# Altium schematic sheet TEC_CONTROLLER_1.SchDoc: Laser PCB
size A3; DrawnBy: James Singleton; Organization: TMC Technology Ltd.; DocumentNumber: 11; Revision: A; SheetNumber: 10; SheetTotal: 18; Drawn Date: 22/12/2020
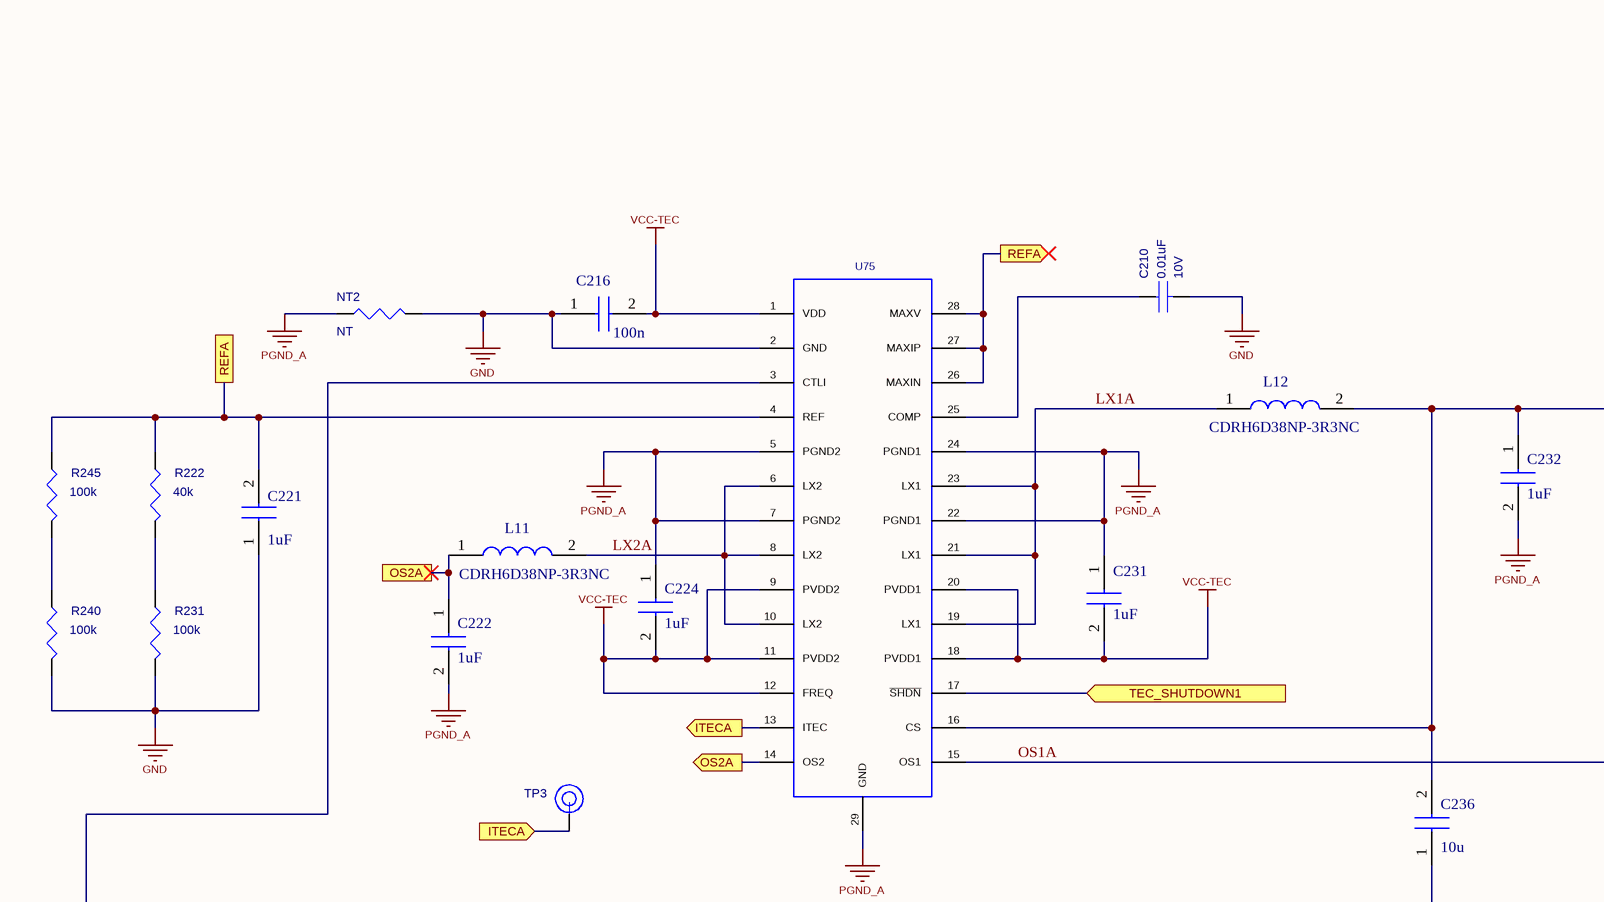
[diagram p0: TEC_CONTROLLER_1.SchDoc, top left]
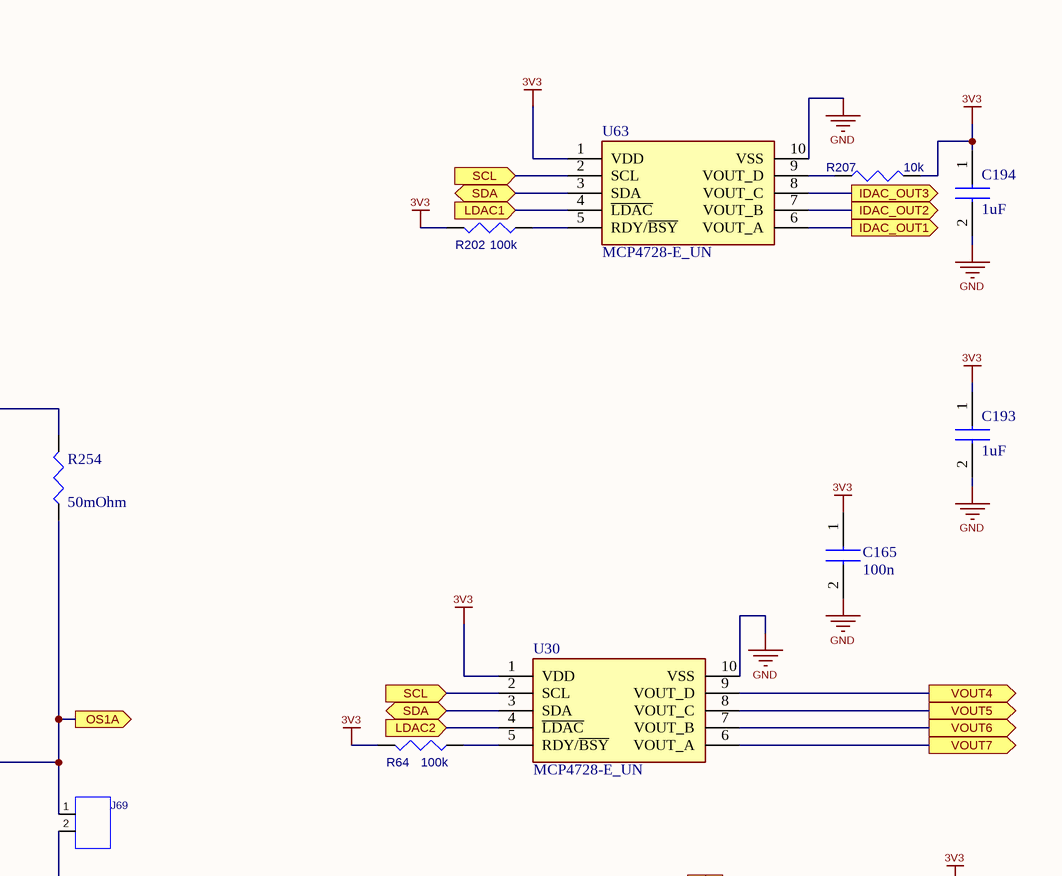
[diagram p1: TEC_CONTROLLER_1.SchDoc, top right]
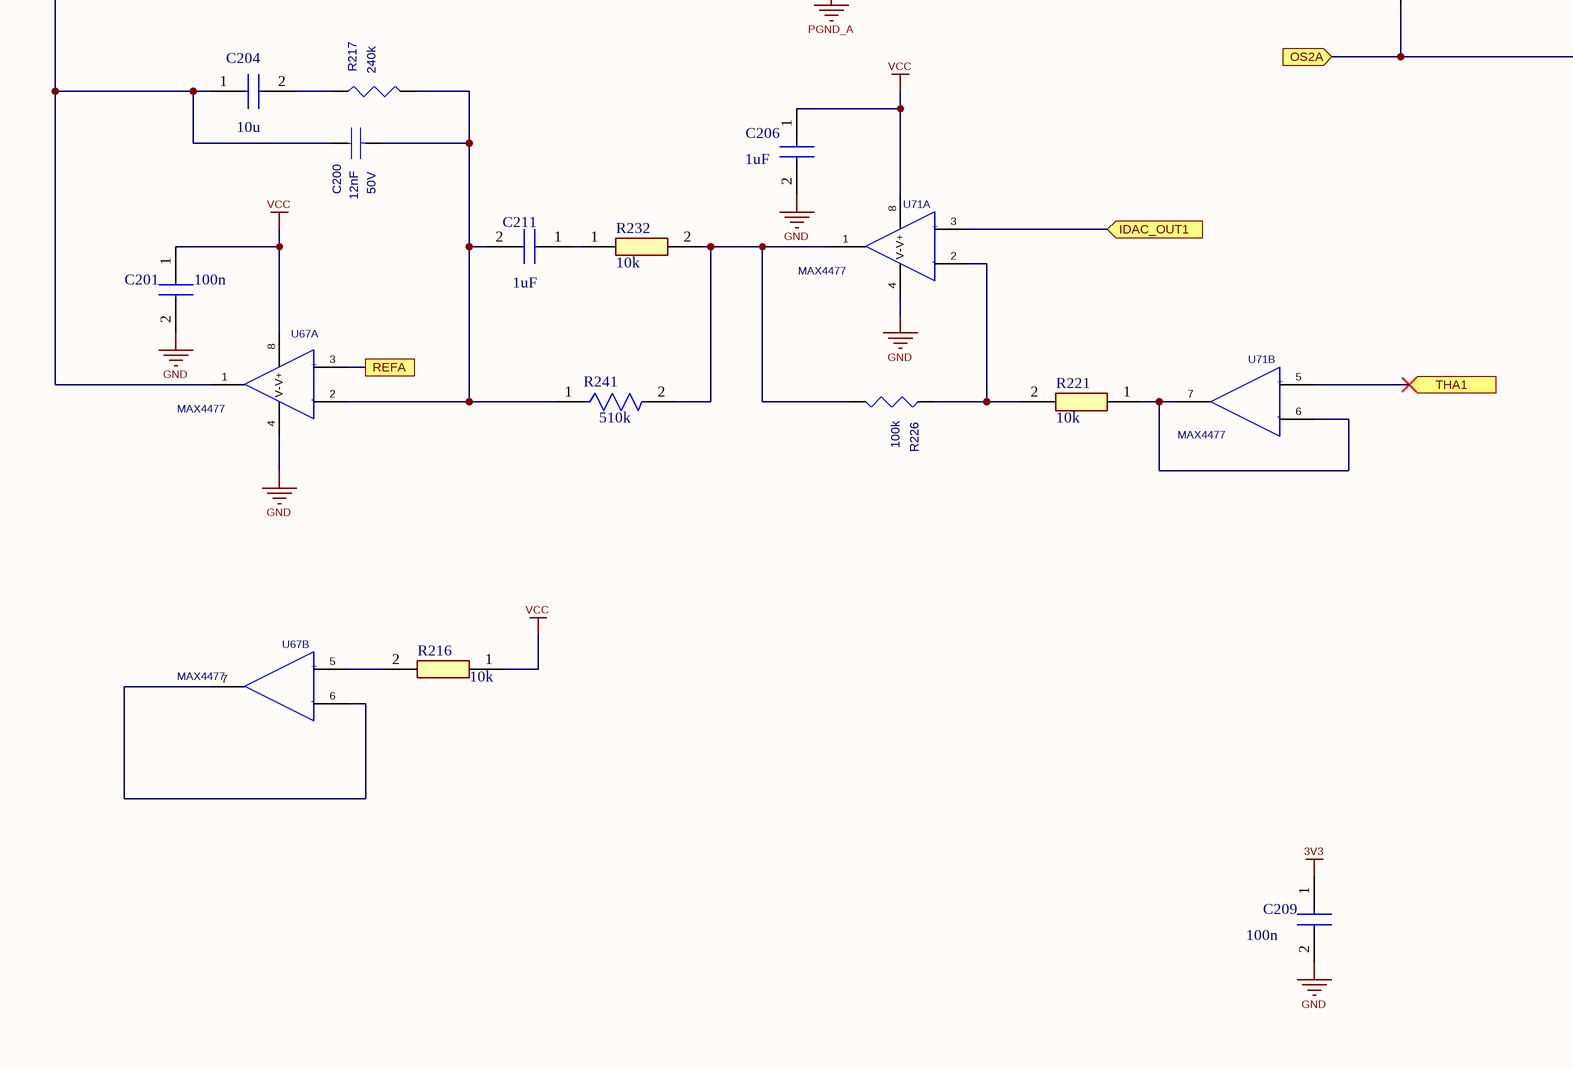
[diagram p2: TEC_CONTROLLER_1.SchDoc, bottom left]
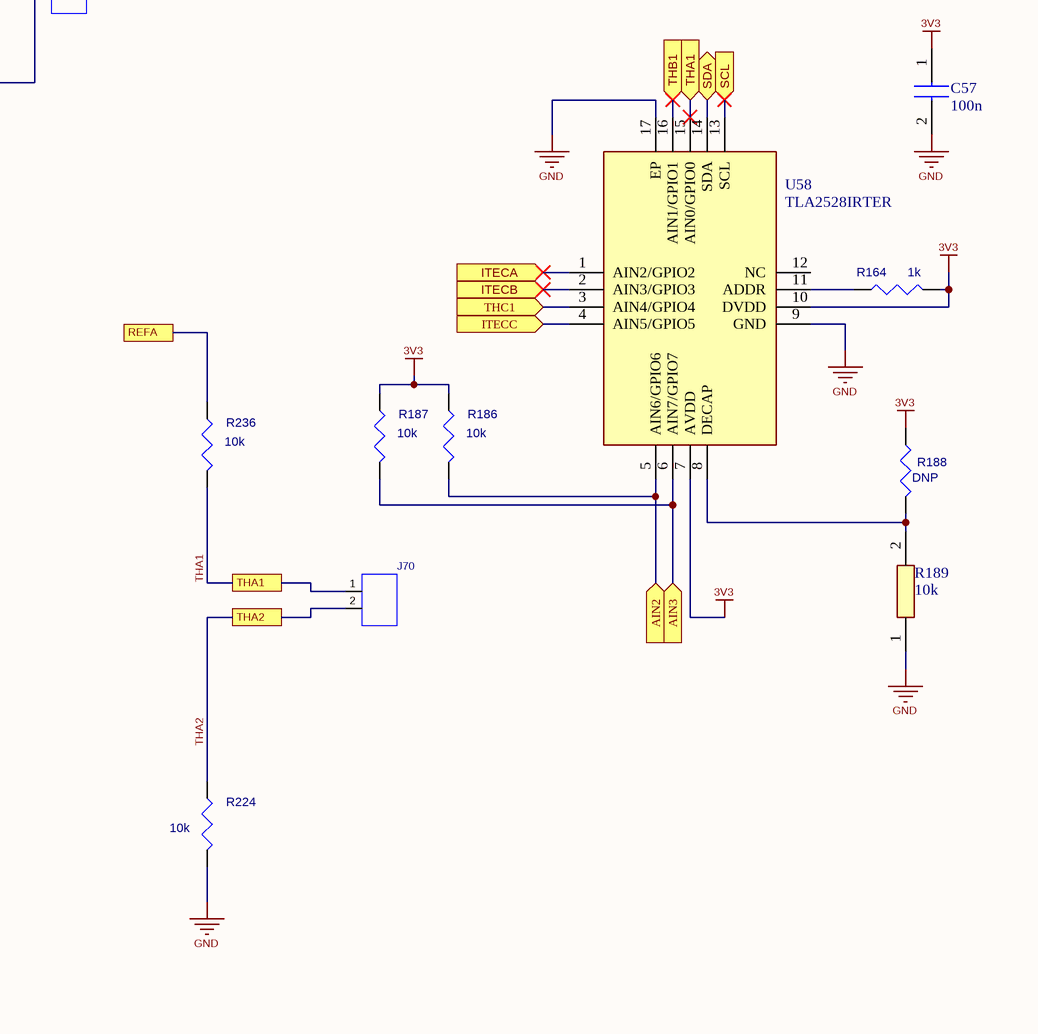
[diagram p3: TEC_CONTROLLER_1.SchDoc, bottom right]

## Parts
C57  100n  [CAPC1608X90N]
C165  100n  [CAPC1608X90N]
C193  1uF  [CAPC1608X95N]
C194  1uF  [CAPC1608X95N]
C200  value 12nF  Rated_Voltage: 50V  [CC0603N]  (hidden comment: 12n)
C201  100n  [CAPC1608X90N]
C204  10u  [CAPC1608X90N]
C206  1uF  [CAPC1608X95N]
C209  100n  [CAPC1608X90N]
C210  value 0.01uF  Rated_Voltage: 10V  [CC0603N]  (hidden comment: 10n)
C211  1uF  [CAPC1608X95N]
C216  100n  [CAPC1608X90N]
C221  1uF  [CAPC1608X95N]
C222  1uF  [CAPC1608X95N]
C224  1uF  [CAPC1608X95N]
C231  1uF  [CAPC1608X95N]
C232  1uF  [CAPC1608X95N]
C236  10u  [CAPC1608X90N]
J69  CON02  [AE-6410-2W-VERTICAL]  (value not drawn)
J70  CON02  [AE-6410-2W-VERTICAL]  (value not drawn)
L11  CDRH6D38NP-3R3NC  [CDRH6D38NP3R3NC]
L12  CDRH6D38NP-3R3NC  [CDRH6D38NP3R3NC]
NT2  value NT  [NetTie]  (hidden comment: Net Tie)  (net tie, no BOM)
R64  100k  [CR0603N]
R164  1k  [CR0603N]
R186  value 10k  [CR0603N]  (hidden comment: RES)
R187  value 10k  [CR0603N]  (hidden comment: RES)
R188  DNP  [CR0603N]
R189  10k  [RESC1608X55N]
R202  100k  [CR0603N]
R207  value 10k  [CR0603N]  (hidden comment: RES)
R216  10k  [RESC1608X55N]
R217  240k  [CR0603N]
R221  10k  [RESC1608X55N]
R222  40k  [CR0603N]
R224  value 10k  [CR0603N]  (hidden comment: RES)
R226  100k  [CR0603N]
R231  100k  [CR0603N]
R232  10k  [RESC1608X55N]
R236  value 10k  [CR0603N]  (hidden comment: RES)
R240  100k  [CR0603N]
R241  Resistance: 510k  [FP-CR0603-MFG]  (hidden comment: CR0603-JW-514ELF)
R245  100k  [CR0603N]
R254  value 50mOhm  [RESC3216X89N]  (hidden comment: PE1206FRE470R05L)
TP3  DNP  [MILLMAX3210]  (value not drawn)
U30  MCP4728-E_UN  [SOP50P490X110-10N]
U58  TLA2528IRTER  [QFN50P300X300X80-17N-D]
U63  MCP4728-E_UN  [SOP50P490X110-10N]
U67  MAX4477  [SOP65P490X110-8CN]  (parts A,B of 2)
U71  MAX4477  [SOP65P490X110-8CN]  (parts A,B of 2)
U75  (no value)  [SOP65P638X110-29N]

## Ports
AIN2 (in), AIN3 (in), IDAC_OUT1 (in, see TEC_CONTROLLER_1[8A]), IDAC_OUT1 (out, see TEC_CONTROLLER_1[4C]), IDAC_OUT2 (out, see TEC_CONTROLLER_2[4C]), IDAC_OUT3 (out, see TEC_CONTROLLER_3[4C]), ITECA (in, see TEC_CONTROLLER_1[2B], TEC_CONTROLLER_1[3B]), ITECA (in, see TEC_CONTROLLER_1[3B], TEC_CONTROLLER_1[7C]), ITECA (out, see TEC_CONTROLLER_1[2B], TEC_CONTROLLER_1[7C]), ITECB (in, see TEC_CONTROLLER_2[2B], TEC_CONTROLLER_2[3B]), ITECC (in, see TEC_CONTROLLER_3[2B], TEC_CONTROLLER_3[3B]), LDAC1 (in, see PI_INTERFACE[3A]), LDAC2 (in, see PI_INTERFACE[3A]), OS1A (out), OS2A (in, see TEC_CONTROLLER_1[2B], TEC_CONTROLLER_1[3B]), OS2A (out, see TEC_CONTROLLER_1[2B], TEC_CONTROLLER_1[5B]), OS2A (see TEC_CONTROLLER_1[3B], TEC_CONTROLLER_1[5B]), REFA (out, see TEC_CONTROLLER_1[1A], TEC_CONTROLLER_1[2C], TEC_CONTROLLER_1[6C]), REFA (see TEC_CONTROLLER_1[1A], TEC_CONTROLLER_1[2C], TEC_CONTROLLER_1[4A]), REFA (see TEC_CONTROLLER_1[1A], TEC_CONTROLLER_1[4A], TEC_CONTROLLER_1[6C]), REFA (see TEC_CONTROLLER_1[2C], TEC_CONTROLLER_1[4A], TEC_CONTROLLER_1[6C]), SCL (in, see ADC-DAC[2C], ADC-DAC[3A], ADC-DAC[4B], ADC-DAC[4C], ADC-DAC[5C], ADC-DAC[6A], Fan & Power Out[6A], PI_INTERFACE[3A], TEC_CONTROLLER_1[6B], TEC_CONTROLLER_1[7A]), SCL (in, see ADC-DAC[2C], ADC-DAC[3A], ADC-DAC[4B], ADC-DAC[4C], ADC-DAC[5C], ADC-DAC[6A], Fan & Power Out[6A], PI_INTERFACE[3A], TEC_CONTROLLER_1[6B], TEC_CONTROLLER_1[8B]), SCL (in, see ADC-DAC[2C], ADC-DAC[3A], ADC-DAC[4B], ADC-DAC[4C], ADC-DAC[5C], ADC-DAC[6A], Fan & Power Out[6A], PI_INTERFACE[3A], TEC_CONTROLLER_1[7A], TEC_CONTROLLER_1[8B]), SDA (bidir, see ADC-DAC[2C], ADC-DAC[3A], ADC-DAC[4B], ADC-DAC[4C], ADC-DAC[5C], ADC-DAC[6A], Fan & Power Out[6A], PI_INTERFACE[3A], TEC_CONTROLLER_1[6B], TEC_CONTROLLER_1[7A]), SDA (bidir, see ADC-DAC[2C], ADC-DAC[3A], ADC-DAC[4B], ADC-DAC[4C], ADC-DAC[5C], ADC-DAC[6A], Fan & Power Out[6A], PI_INTERFACE[3A], TEC_CONTROLLER_1[6B], TEC_CONTROLLER_1[7B]), SDA (bidir, see ADC-DAC[2C], ADC-DAC[3A], ADC-DAC[4B], ADC-DAC[4C], ADC-DAC[5C], ADC-DAC[6A], Fan & Power Out[6A], PI_INTERFACE[3A], TEC_CONTROLLER_1[7A], TEC_CONTROLLER_1[7B]), TEC_SHUTDOWN1 (in, see PIO[2C]), THA1 (in, see TEC_CONTROLLER_1[5C], TEC_CONTROLLER_1[6C]), THA1 (in, see TEC_CONTROLLER_1[6C], TEC_CONTROLLER_1[7B]), THA1 (see TEC_CONTROLLER_1[5C], TEC_CONTROLLER_1[7B]), THA2, THB1 (in, see TEC_CONTROLLER_2[5C], TEC_CONTROLLER_2[6D]), THC1 (in, see TEC_CONTROLLER_3[5C], TEC_CONTROLLER_3[6D]), VOUT4 (out, see LIM+LEDS+POWER[1A]), VOUT5 (out, see LIM+LEDS+POWER[1B]), VOUT6 (out, see LIM+LEDS+POWER[1C]), VOUT7 (out, see LIM+LEDS+POWER[1C])

## Nets
3V3: C57.1 C165.1 C193.1 C194.1 C209.1 R64.1 R164.2 R186.1 R187.1 R188.1 R202.1 R207.2 U30.1(VDD) U58.7(AVDD) U58.10(DVDD) U63.1(VDD)
GND: C57.2 C165.2 C193.2 C194.2 C201.2 C206.2 C209.2 C210.2 C216.1 C221.1 NT2.1 R189.1 R224.2 R231.2 R240.2 U30.10(VSS) U58.9(GND) U58.17(EP) U63.10(VSS) U67.4(V-) U71.4(V-) U75.2(GND)
PGND_A: C222.2 C224.1 C231.1 C232.2 NT2.2 U75.5(PGND2) U75.7(PGND2) U75.22(PGND1) U75.24(PGND1) U75.29(GND)
VCC: C201.1 C206.1 R216.1 U67.8(V+) U71.8(V+)
VCC-TEC: C216.2 C224.2 C231.2 U75.1(VDD) U75.9(PVDD2) U75.11(PVDD2) U75.12(FREQ) U75.18(PVDD1) U75.20(PVDD1)
AIN2: R186.2 U58.5(AIN6/GPIO6) ; port AIN2
AIN3: R187.2 U58.6(AIN7/GPIO7) ; port AIN3
IDAC_OUT1: U63.6(VOUT_A) U71.3 ; port IDAC_OUT1
IDAC_OUT2: U63.7(VOUT_B) ; port IDAC_OUT2
IDAC_OUT3: U63.8(VOUT_C) ; port IDAC_OUT3
ITECA: TP3.1 U58.1(AIN2/GPIO2) U75.13(ITEC) ; port ITECA
ITECB: U58.2(AIN3/GPIO3) ; port ITECB
ITECC: U58.4(AIN5/GPIO5) ; port ITECC
LDAC1: U63.4(~{LDAC}) ; port LDAC1
LDAC2: U30.4(~{LDAC}) ; port LDAC2
LX1A: L12.1 U75.19(LX1) U75.21(LX1) U75.23(LX1)
LX2A: L11.2 U75.6(LX2) U75.8(LX2) U75.10(LX2)
OS1A: J69.1 R254.1 U75.15(OS1) ; port OS1A
OS2A: C222.1 C236.1 J69.2 L11.1 U75.14(OS2) ; port OS2A
REFA: C221.2 R222.1 R236.1 R245.1 U67.3 U75.4(REF) U75.26(MAXIN) U75.27(MAXIP) U75.28(MAXV) ; port REFA
SCL: U30.2(SCL) U58.13(SCL) U63.2(SCL) ; port SCL
SDA: U30.3(SDA) U58.14(SDA) U63.3(SDA) ; port SDA
TEC_SHUTDOWN1: U75.17(~{SHDN}) ; port TEC_SHUTDOWN1
THA1: J70.1 R236.2 U58.15(AIN0/GPIO0) U71.5 ; port THA1
THA2: J70.2 R224.1 ; port THA2
THB1: U58.16(AIN1/GPIO1) ; port THB1
THC1: U58.3(AIN4/GPIO4) ; port THC1
VOUT4: U30.9(VOUT_D) ; port VOUT4
VOUT5: U30.8(VOUT_C) ; port VOUT5
VOUT6: U30.7(VOUT_B) ; port VOUT6
VOUT7: U30.6(VOUT_A) ; port VOUT7
NetC200_1: C200.1 C204.1 U67.1 U75.3(CTLI)
NetC200_2: C200.2 C211.2 R217.2 R241.1 U67.2
NetC204_2: C204.2 R217.1
NetC210_1: C210.1 U75.25(COMP)
NetC211_1: C211.1 R232.1
NetC232_1: C232.1 C236.2 L12.2 R254.2 U75.16(CS)
NetR64_2: R64.2 U30.5(RDY/~{BSY})
NetR164_1: R164.1 U58.11(ADDR)
NetR188_2: R188.2 R189.2 U58.8(DECAP)
NetR202_2: R202.2 U63.5(RDY/~{BSY})
NetR207_1: R207.1 U63.9(VOUT_D)
NetR216_2: R216.2 U67.5
NetR221_1: R221.1 U71.6 U71.7
NetR221_2: R221.2 R226.1 U71.2
NetR222_2: R222.2 R231.1
NetR226_2: R226.2 R232.2 R241.2 U71.1
NetR240_1: R240.1 R245.2
NetU67_6: U67.6 U67.7

Not connected (* = marked no-connect by the designer): U58 12(NC)

## Notes on the sheet
- TMC Technology Ltd.
- Page Contents:
- Project:
- Variant:
- Checked By:
- Size:
- Date:
- Dwg No:
- Sheet
- of
- Revision:
- (in symbol MAX4477, part A) +; -
- (in symbol MAX4477, part B) +; -

## Library data of the parts
C57 C165 C201 C209 C216 = CL10B104KB85PNC: Capacitor; Manufacturer_Name: SAMSUNG; Datasheet Link: https://product.samsungsem.com/mlcc/CL10B104KB85PN.do; Height: 0.9mm; Manufacturer_Part_Number: CL10B104KB85PNC; Mouser Part Number: 187-CL10B104KB85PNC; Mouser Price/Stock: https://www.mouser.co.uk/ProductDetail/Samsung-Electro-Mechanics/CL10B104KB85PNC?qs=349EhDEZ59rqeQxdKfSn5w%3D%3D; Arrow Part Number: CL10B104KB85PNC; Arrow Price/Stock: https://www.arrow.com/en/products/cl10b104kb85pnc/samsung-electro-mechanics
  C201 C209 C216: ClassName: TEC1
C193 C194 C206 C211 C221 C222 C224 C231 C232 = CL10B105KB8NQNC: Capacitor; Manufacturer_Name: SAMSUNG; Datasheet Link: https://product.samsungsem.com/mlcc/CL10B105KB8NQN.do; Height: 0.95mm; Manufacturer_Part_Number: CL10B105KB8NQNC; Mouser Part Number: 187-CL10B105KB8NQNC; Mouser Price/Stock: https://www.mouser.co.uk/ProductDetail/Samsung-Electro-Mechanics/CL10B105KB8NQNC?qs=Jm2GQyTW%2FbjBq1uiSyA2AQ%3D%3D; Arrow Part Number: CL10B105KB8NQNC; Arrow Price/Stock: https://www.arrow.com/en/products/cl10b105kb8nqnc/samsung-electro-mechanics?region=europe
  C206 C211 C221 C222 C224 C231 C232: ClassName: TEC1
C200 = CAP: Cap., 0.012µF ±10% 50V Ceramic X7R 0603 (1608 Metric); PART_NUMBER: 478-1228-1-ND; Manufacturer: AVX; Manufacturer_PN: 06035C123KAT2A; FPLIST: CC0603N,CC0603L,CC0603M; Dielectric_Type: X5R; CLASS: DISCRETE; Source_Path: \\MIL-NS1\CIP\SCHEMATIC_SYMBOLS\LTC_CAPACITOR.OLB; Geometry.Height: 37.40mil; Package_Size: 0603; Package_Type: SMD; Tolerance: 10%; PCB DECAL: CC0603N; ClassName: TEC1
C204 C236 = GRM188Z71A106MA73J: Capacitor; Manufacturer_Name: Murata Electronics; Value: 10uF; Datasheet Link: http://componentsearchengine.com/Datasheets/1/GRM188Z71A106MA73J.pdf; Height: 0.9mm; Manufacturer_Part_Number: GRM188Z71A106MA73J; Mouser Part Number: 81-GRM188Z71A106MA3J; Mouser Price/Stock: https://www.mouser.com/Search/Refine.aspx?Keyword=81-GRM188Z71A106MA3J; Arrow Part Number: GRM188Z71A106MA73J; Arrow Price/Stock: https://www.arrow.com/en/products/grm188z71a106ma73j/murata-manufacturing; ClassName: TEC1
C210 = CAP: CAP.,0.01uF,X5R,10V,10%,0603; Manufacturer_PN: 0603ZD103KAT2A; Manufacturer: AVX; CLASS: DISCRETE; FPLIST: CC0603N,CC0603L,CC0603M; Source_Path: \\MIL-NS1\CIP\SCHEMATIC_SYMBOLS\LTC_CAPACITOR.OLB; Geometry.Height: 37.40mil; Tolerance: 10%; Dielectric_Type: X5R; Package_Size: 0603; PCB DECAL: CC0603N; ClassName: TEC1
J69 J70 = CON02: 2 pin Connector; Manufacturer: Molex; UNNAMED1: DNF; Order No: 1360130; PCB DECAL: AE-6410-2W-VERTICAL; Part No: 22-29-2021; ClassName: TEC1
  J70: System: Connector
L11 L12 = CDRH6D38NP-3R3NC: Inductor; Manufacturer_Name: Sumida; Datasheet Link: http://products.sumida.com/products/pdf/CDRH6D38.pdf; Manufacturer_Part_Number: CDRH6D38NP-3R3NC; Mouser Part Number: 851-CDRH6D38NP-3R3NC; Mouser Price/Stock: https://www.mouser.co.uk/ProductDetail/Sumida/CDRH6D38NP-3R3NC?qs=yEEOfDmvQDXre4MvBRE7jQ%3D%3D; Arrow Part Number: CDRH6D38NP-3R3NC; Arrow Price/Stock: https://www.arrow.com/en/products/cdrh6d38np-3R3nc/sumida?region=nac; Height: 4mm
NT2 = NetTie: Manufacturer_PN: ERJ3EKF1002V; Manufacturer: PANASONIC; Part No: P10.0KHCT-ND; PCB DECAL: CR0603N; CLASS: DISCRETE; Rated_Power: 1/10W; Tolerance: 1%; Temperature_Coefficient: 100ppm/C; FPLIST: CR0603N,CR0603L,CR0603M; Source_Path: \\MIL-NS1\CIP\SCHEMATIC_SYMBOLS\LTC_RESISTOR.OLB; Geometry.Height: 37.40mil; Package_Size: 0603
R64 R202 R226 R231 R240 R245 = RES: RES.,100k OHMS,1%,1/10W,0603; Manufacturer_PN: ERJ3EKF1003V; Manufacturer: PANASONIC; PART_NUMBER: P100KHCT-ND; CLASS: DISCRETE; Temperature_Coefficient: 100ppm/C; FPLIST: CR0603N,CR0603L,CR0603M; Source_Path: \\MIL-NS1\CIP\SCHEMATIC_SYMBOLS\LTC_RESISTOR.OLB; Geometry.Height: 37.40mil; PCB DECAL: CR0603N; Rated_Power: 1/10W; Tolerance: 1%; Package_Size: 0603; Value: 100k
  R226 R231 R240 R245: ClassName: TEC1
R164 = RES: RES.,1k OHMS,1%,1/10W,0603; Manufacturer_PN: ERJ3EKF1001V; Manufacturer: PANASONIC; PART_NUMBER: P1.0KHCT-ND; CLASS: DISCRETE; Temperature_Coefficient: 100ppm/C; FPLIST: CR0603N,CR0603L,CR0603M; Source_Path: \\MIL-NS1\CIP\SCHEMATIC_SYMBOLS\LTC_RESISTOR.OLB; Geometry.Height: 37.40mil; PCB DECAL: CR0603N; Rated_Power: 1/10W; Tolerance: 1%; Package_Size: 0603; Value: 1k
R186 R187 R207 R224 R236 = RES: RES.,10k OHMS,1%,1/10W,0603; Manufacturer_PN: ERJ3EKF1002V; Manufacturer: PANASONIC; Part No: P10.0KHCT-ND; CLASS: DISCRETE; Temperature_Coefficient: 100ppm/C; FPLIST: CR0603N,CR0603L,CR0603M; Source_Path: \\MIL-NS1\CIP\SCHEMATIC_SYMBOLS\LTC_RESISTOR.OLB; Geometry.Height: 37.40mil; PCB DECAL: CR0603N; Rated_Power: 1/10W; Tolerance: 1%; Package_Size: 0603
  R186 R187 R224 R236: ClassName: TEC1
R188 = RES_1: RES.,10k OHMS,1%,1/10W,0603; Manufacturer_PN: ERJ3EKF1002V; Manufacturer: PANASONIC; Part No: P10.0KHCT-ND; CLASS: DISCRETE; Temperature_Coefficient: 100ppm/C; FPLIST: CR0603N,CR0603L,CR0603M; Source_Path: \\MIL-NS1\CIP\SCHEMATIC_SYMBOLS\LTC_RESISTOR.OLB; Geometry.Height: 37.40mil; PCB DECAL: CR0603N; Rated_Power: 1/10W; Tolerance: 1%; Package_Size: 0603; Value: DNP
R189 R216 R221 R232 = CR0603-JW-103ELF: Resistor; Manufacturer_Name: Bourns; Datasheet Link: https://www.bourns.com/pdfs/chpreztr.pdf; Height: 0.55mm; Manufacturer_Part_Number: CR0603-JW-103ELF; Mouser Part Number: 652-CR0603-JW-103ELF; Mouser Price/Stock: https://www.mouser.co.uk/ProductDetail/Bourns/CR0603-JW-103ELF?qs=tprK%2FdUq6q6vORSl%252Bpo4rg%3D%3D; Arrow Part Number: CR0603-JW-103ELF; Arrow Price/Stock: https://www.arrow.com/en/products/cr0603-jw-103elf/bourns?utm_currency=USD&region=nac
R217 = RES: RES.,240k OHMS,1%,1/10W,0603; Manufacturer: PANASONIC; CLASS: DISCRETE; Temperature_Coefficient: 100ppm/C; FPLIST: CR0603N,CR0603L,CR0603M; Source_Path: \\MIL-NS1\CIP\SCHEMATIC_SYMBOLS\LTC_RESISTOR.OLB; Geometry.Height: 37.40mil; PCB DECAL: CR0603N; Rated_Power: 1/10W; Tolerance: 1%; Package_Size: 0603; Value: 240k; ClassName: TEC1
R222 = RES: RES.,40k OHMS,1%,1/10W,0603; Manufacturer_PN: CRCW0603560KFKEA; Manufacturer: VISHAY; PART_NUMBER: 2138575; CLASS: DISCRETE; Temperature_Coefficient: 100ppm/C; FPLIST: CR0603N,CR0603L,CR0603M; Source_Path: \\MIL-NS1\CIP\SCHEMATIC_SYMBOLS\LTC_RESISTOR.OLB; Geometry.Height: 37.40mil; PCB DECAL: CR0603N; Rated_Power: 1/10W; Tolerance: 1%; Package_Size: 0603; Value: 40k; ClassName: TEC1
R241 = CMP-07231-004798-1: Thick Film Chip Resistors 0603 510kΩ 0.1W 5% 200ppm/°C; Max Power Dissipation: 100mW; Voltage Rating: 50V; Number of Terminations: 2; Radiation Hardening: No; Features: Moisture Resistant; Military Standard: Not; Width: 0.031inch; Case Code (Imperial): 0603; Tolerance: 5%; Height: 0.022inch; Min Operating Temperature: -55°C; Packaging: Tape and Reel; Case Code (Metric): 1608; Contact Plating: Tin; Mount: Surface Mount; Max Operating Temperature: 155°C; Length: 1.6mm; Temperature Coefficient: 200ppm/°C; Power Rating: 100mW; Depth: 0.8mm; Termination: SMD/SMT; Composition: Thick Film; Package Quantity: 5000; Thickness: 457um; Case/Package: 0603
R254 = PE1206FRE470R05L: Resistor; Manufacturer_Name: YAGEO; Datasheet Link: https://www.yageo.com/upload/media/product/productsearch/datasheet/rchip/PYu-PE_521_RoHS_L_10.pdf; Height: 0.89mm; Manufacturer_Part_Number: PE1206FRE470R05L; Mouser Part Number: 603-PE1206FRE470R05L; Mouser Price/Stock: https://www.mouser.co.uk/ProductDetail/YAGEO/PE1206FRE470R05L?qs=eP2BKZSCXI5fQbfM3JSqUA%3D%3D
TP3 = MILLMAX3210: TEST POINT,TURRET,0.031",MTG. HOLE; Manufacturer_PN: 3210-2-00-01-00-00-08-0; Manufacturer: MILL-MAX; PART_FIELD_01: GND; Value: TEST POINT, DNF; Source_Path: \\MIL-NS1\CIP\SCHEMATIC_SYMBOLS\LTC_HARDWARE.OLB; CLASS: IO; PCB DECAL: MILLMAX3210; ClassName: TEC1
U30 U63 = MCP4728-E_UN: Integrated Circuit; Manufacturer_Name: Microchip; Manufacturer_Part_Number: MCP4728-E/UN; Datasheet Link: http://ww1.microchip.com/downloads/en/DeviceDoc/22187E.pdf; Height: 1.1mm; Mouser Part Number: 579-MCP4728-E/UN; Mouser Price/Stock: https://www.mouser.co.uk/ProductDetail/Microchip-Technology-Atmel/MCP4728-E-UN?qs=E6wAi2XWqcP2zTenScklGA%3D%3D; Arrow Part Number: MCP4728-E/UN; Arrow Price/Stock: https://www.arrow.com/en/products/mcp4728-eun/microchip-technology?region=nac
U58 = TLA2528IRTER: Integrated Circuit; Manufacturer_Name: Texas Instruments; Datasheet Link: https://www.ti.com/lit/ds/symlink/tla2528.pdf?ts=1596615195592&ref_url=https%253A%252F%252Fwww.ti.com%252Fproduct%252FTLA2528%253Futm_source%253Dgoogle%2526utm_medium%253Dcpc%2526utm_campaign%253Dasc-null-null-gpn_en-cpc-pf-google-eu%2526utm_content%253Dt; Height: 0.8mm; Manufacturer_Part_Number: TLA2528IRTER; Mouser Part Number: 595-TLA2528IRTER; Mouser Price/Stock: https://www.mouser.co.uk/ProductDetail/Texas-Instruments/TLA2528IRTER?qs=%252B6g0mu59x7KfRzJN7APgZw%3D%3D; Arrow Part Number: TLA2528IRTER; Arrow Price/Stock: https://www.arrow.com/en/products/tla2528irter/texas-instruments?region=nac
U67 U71 = MAX4477: Manufacturer: Maxim; Part No: MAX4477AUA+; Geometry.Height: 1.1mm; Order No: 2510956; PCB DECAL: SOP65P490X110-8CN; ClassName: TEC1
U75 = MAX1968: Thermoelectric Cooler PMIC 28-TSSOP-EP; Part No: MAX1969; Manufacturer: Maxim; Geometry.Height: 1.1mm; Order No: 2514258; PCB DECAL: SOP65P638X110-29N; ClassName: TEC1